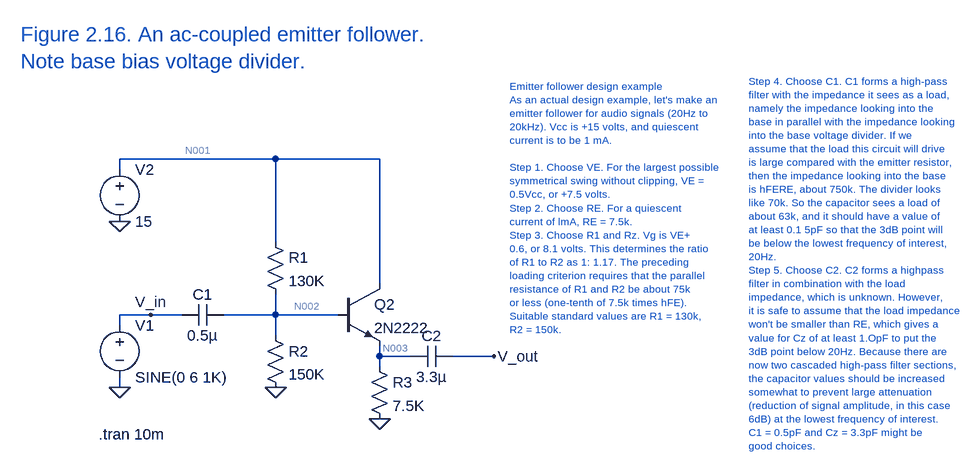
[diagram p0: schematic 02_16 - AC coupled emitter follower.asc]
02_16 - AC coupled emitter follower.asc, the LTspice schematic file:
Version 4
SHEET 1 940 852
WIRE -624 64 -864 64
WIRE -464 64 -624 64
WIRE -864 80 -864 64
WIRE -624 192 -624 64
WIRE -464 256 -464 64
WIRE -816 304 -864 304
WIRE -768 304 -816 304
WIRE -624 304 -624 272
WIRE -624 304 -704 304
WIRE -528 304 -624 304
WIRE -864 320 -864 304
WIRE -624 336 -624 304
WIRE -464 368 -464 352
WIRE -416 368 -464 368
WIRE -288 368 -352 368
WIRE -464 384 -464 368
WIRE -864 416 -864 400
FLAG -864 416 0
FLAG -864 160 0
FLAG -624 416 0
FLAG -464 464 0
FLAG -816 304 V_in
FLAG -288 368 V_out
SYMBOL res -640 176 R0
SYMATTR InstName R1
SYMATTR Value 130K
SYMBOL res -640 320 R0
SYMATTR InstName R2
SYMATTR Value 150K
SYMBOL cap -704 288 R90
WINDOW 0 0 32 VBottom 2
WINDOW 3 32 32 VTop 2
SYMATTR InstName C1
SYMATTR Value 0.5µ
SYMBOL voltage -864 304 R0
WINDOW 123 0 0 Left 2
WINDOW 39 0 0 Left 2
SYMATTR InstName V1
SYMATTR Value SINE(0 6 1K)
SYMBOL voltage -864 64 R0
WINDOW 123 0 0 Left 2
WINDOW 39 0 0 Left 2
SYMATTR InstName V2
SYMATTR Value 15
SYMBOL npn -528 256 R0
SYMATTR InstName Q2
SYMATTR Value 2N2222
SYMBOL res -480 368 R0
SYMATTR InstName R3
SYMATTR Value 7.5K
SYMBOL cap -352 352 R90
WINDOW 0 0 32 VBottom 2
WINDOW 3 32 32 VTop 2
SYMATTR InstName C2
SYMATTR Value 3.3µ
TEXT -896 488 Left 2 !.tran 10m
TEXT -1016 -128 Left 3 ;Figure 2.16. An ac-coupled emitter follower.\nNote base bias voltage divider.
TEXT -264 -48 Left 1 ;Emitter follower design example\nAs an actual design example, let's make an\nemitter follower for audio signals (20Hz to\n20kHz). Vcc is +15 volts, and quiescent\ncurrent is to be 1 mA.\n \nStep 1. Choose VE. For the largest possible\nsymmetrical swing without clipping, VE =\n0.5Vcc, or +7.5 volts.\nStep 2. Choose RE. For a quiescent\ncurrent of lmA, RE = 7.5k.\nStep 3. Choose R1 and Rz. Vg is VE+\n0.6, or 8.1 volts. This determines the ratio\nof R1 to R2 as 1: 1.17. The preceding\nloading criterion requires that the parallel\nresistance of R1 and R2 be about 75k\nor less (one-tenth of 7.5k times hFE).\nSuitable standard values are R1 = 130k,\nR2 = 150k.
TEXT 104 -56 Left 1 ;Step 4. Choose C1. C1 forms a high-pass\nfilter with the impedance it sees as a load,\nnamely the impedance looking into the\nbase in parallel with the impedance looking\ninto the base voltage divider. If we\nassume that the load this circuit will drive\nis large compared with the emitter resistor,\nthen the impedance looking into the base\nis hFERE, about 750k. The divider looks\nlike 70k. So the capacitor sees a load of\nabout 63k, and it should have a value of\nat least 0.1 5pF so that the 3dB point will\nbe below the lowest frequency of interest,\n20Hz.\nStep 5. Choose C2. C2 forms a highpass\nfilter in combination with the load\nimpedance, which is unknown. However,\nit is safe to assume that the load impedance\nwon't be smaller than RE, which gives a\nvalue for Cz of at least 1.OpF to put the\n3dB point below 20Hz. Because there are\nnow two cascaded high-pass filter sections,\nthe capacitor values should be increased\nsomewhat to prevent large attenuation\n(reduction of signal amplitude, in this case\n6dB) at the lowest frequency of interest.\nC1 = 0.5pF and Cz = 3.3pF might be\ngood choices.

The netlist it stands for:
* 02_16 - AC coupled emitter follower.asc
R1 N001 N002 130K
R2 N002 0 150K
C1 N002 V_in 0.5µ
V1 V_in 0 SINE(0 6 1K)
V2 N001 0 15
Q2 N001 N002 N003 0 2N2222
R3 N003 0 7.5K
C2 V_out N003 3.3µ
.model NPN NPN
.model PNP PNP
.lib standard.bjt
.tran 10m
* Figure 2.16. An ac-coupled emitter follower.
* Note base bias voltage divider.
* Emitter follower design example
* As an actual design example, let's make an
* emitter follower for audio signals (20Hz to
* 20kHz). Vcc is +15 volts, and quiescent
* current is to be 1 mA.
* Step 1. Choose VE. For the largest possible
* symmetrical swing without clipping, VE =
* 0.5Vcc, or +7.5 volts.
* Step 2. Choose RE. For a quiescent
* current of lmA, RE = 7.5k.
* Step 3. Choose R1 and Rz. Vg is VE+
* 0.6, or 8.1 volts. This determines the ratio
* of R1 to R2 as 1: 1.17. The preceding
* loading criterion requires that the parallel
* resistance of R1 and R2 be about 75k
* or less (one-tenth of 7.5k times hFE).
* Suitable standard values are R1 = 130k,
* R2 = 150k.
* Step 4. Choose C1. C1 forms a high-pass
* filter with the impedance it sees as a load,
* namely the impedance looking into the
* base in parallel with the impedance looking
* into the base voltage divider. If we
* assume that the load this circuit will drive
* is large compared with the emitter resistor,
* then the impedance looking into the base
* is hFERE, about 750k. The divider looks
* like 70k. So the capacitor sees a load of
* about 63k, and it should have a value of
* at least 0.1 5pF so that the 3dB point will
* be below the lowest frequency of interest,
* 20Hz.
* Step 5. Choose C2. C2 forms a highpass
* filter in combination with the load
* impedance, which is unknown. However,
* it is safe to assume that the load impedance
* won't be smaller than RE, which gives a
* value for Cz of at least 1.OpF to put the
* 3dB point below 20Hz. Because there are
* now two cascaded high-pass filter sections,
* the capacitor values should be increased
* somewhat to prevent large attenuation
* (reduction of signal amplitude, in this case
* 6dB) at the lowest frequency of interest.
* C1 = 0.5pF and Cz = 3.3pF might be
* good choices.
.backanno
.end

* Results of the author's LTspice run, read from the files saved beside the schematic
* Operating Point, zero values left out:
*   V(n001) = 15 V
*   V(n002) = 7.73 V
*   V(n003) = 7.078 V
*   V(v_out) = 23.36 µV
*   Ic(Q2) = 939.3 µA
*   Ib(Q2) = 4.391 µA
*   Ie(Q2) = -943.7 µA
*   I(R3) = 943.7 µA
*   I(R2) = 51.53 µA
*   I(R1) = 55.92 µA
*   I(V2) = -995.2 µA
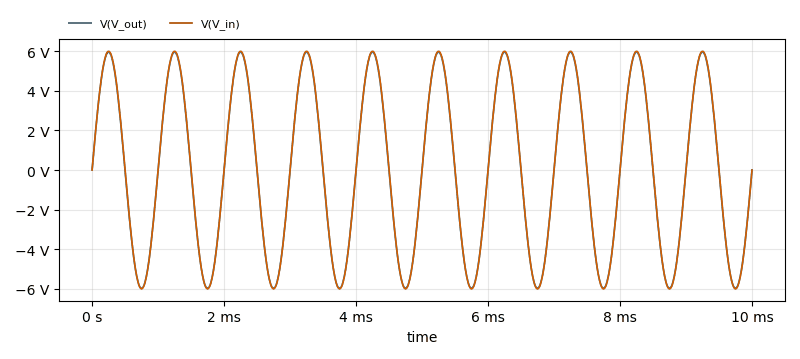
[diagram p1: Transient Analysis of 02_16 - AC coupled emitter follower.asc, plotted from the saved traces]
* Transient Analysis, 1 run:
*   V(V_out): min -5.972 V, max 5.953 V, average -18.92 mV, rms 4.22 V, last 5.447 mV
*   V(V_in): min -5.994 V, max 5.994 V, average -68.8 µV, rms 4.241 V, last 0 V